# EAGLE design clipper_and_clamper (EAGLE 6.1)
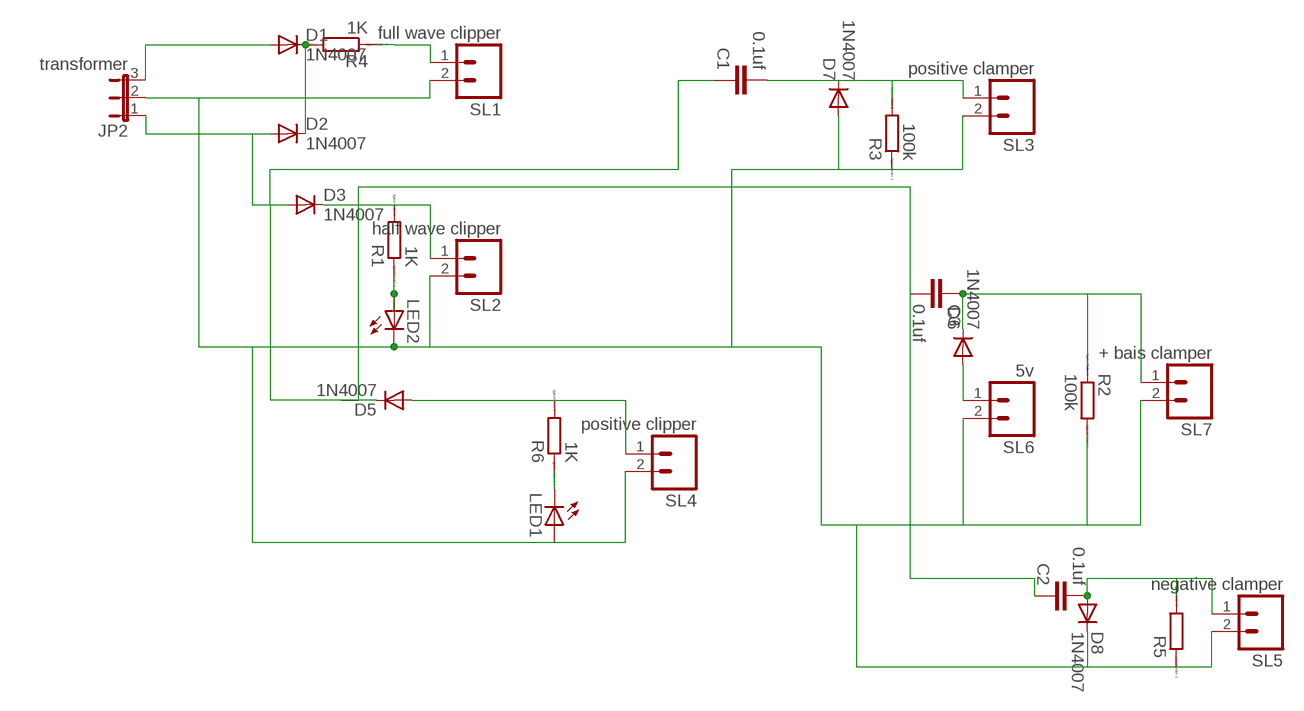
[diagram p0: schematic, sheet 1]

## Parts
C1  0.1uf  C2,5-3  [C2.5-3]
C2  0.1uf  C2,5-3  [C2.5-3]
C3  0.1uf  C2,5-3  [C2.5-3]
D1  1N4007  1N4004  [DO41-10]
D2  1N4007  1N4004  [DO41-10]
D3  1N4007  1N4004  [DO41-10]
D5  1N4007  1N4004  [DO41-10]
D6  1N4007  1N4004  [DO41-10]
D7  1N4007  1N4004  [DO41-10]
D8  1N4007  1N4004  [DO41-10]
JP2  transformer  JP2E  [JP2]
LED1  LED3MM  [LED3MM]
LED2  LED3MM  [LED3MM]
R1  1K  R0204/7  [0204/7]
R2  100k  R0204/7  [0204/7]
R3  100k  R0204/7  [0204/7]
R4  1K  R0204/7  [0204/7]
R5  R0204/7  [0204/7]
R6  1K  R0204/7  [0204/7]
SL1  full wave clipper  M02  [02P]
SL2  half wave clipper  M02  [02P]
SL3  positive clamper  M02  [02P]
SL4  positive clipper  M02  [02P]
SL5  negative clamper  M02  [02P]
SL6  5v  M02  [02P]
SL7  + bais clamper  M02  [02P]

## Nets
N$1: D1.C D2.C R4.2
N$2: D1.A JP2.3
N$3: C1.1 C2.1 C3.2 D2.A D3.A D5.C JP2.1
N$4: D7.A D8.C JP2.2 LED1.A LED2.K(C) R2.2 R3.1 R5.1 SL1.2 SL2.2 SL3.2 SL4.2 SL5.2 SL6.2 SL7.2
N$5: R4.1 SL1.1
N$6: D3.C R1.2 SL2.1
N$7: LED2.A R1.1
N$8: C2.2 D8.A R5.2 SL5.1
N$9: D5.A R6.2 SL4.1
N$10: LED1.K(C) R6.1
N$11: C1.2 D7.C R3.2 SL3.1
N$13: D6.A SL6.1
N$15: C3.1 D6.C R2.1 SL7.1

## Library data of the parts
C1-C3 = capacitor-wima:C: CAPACITOR naming: grid - package width
D1-D3 D5-D8 = diode:1N4004: DIODE general purpose rectifier, 1 A
JP2 = jumper:JP2E: JUMPER
LED1 LED2 = led:LED: LED OSRAM: - CHIPLED LG R971, LG N971, LY N971, LG Q971, LY Q971, LO R971, LY R971 LH N974, LH R974 LS Q976, LO Q976, LY Q976 LO Q996 - Hyper CHIPLED LW Q18S LB Q993, LB Q99A, LB R99A - SideLED LS A670, LO A670, LY A670, LG A670, LP A670 LB A673, LV A673, LT A673, LW A673 LH A674 LY A675 LS A676, LA A676, LO A676, LY A676, LW A676 LS A679, LY A679, LG A679 - Hyper Micro SIDELED® LS Y876, LA Y876, LO Y876, LY Y876 LT Y87S - SmartLED LW L88C, LW L88S LB L89C, LB L89S, LG L890 LS L89K, LO L89K, LY L89K LS L896, LA L896, LO L896, LY L896 - TOPLED LS T670, LO T670, LY T670, LG T670, LP T670 LSG T670, LSP T670, LSY T670, LOP T670, LYG T670 LG T671, LOG T671, LSG T671 LB T673, LV T673, LT T673, LW T673 LH T674 LS T676, LA T676, LO T676, LY T676, LB T676, LH T676, LSB T676, LW T676 LB T67C, LV T67C, LT T67C, LS T67K, LO T67K, LY T67K, LW E67C LS E67B, LA E67B, LO E67B, LY E67B, LB E67C, LV E67C, LT E67C LW T67C LS T679, LY T679, LG T679 LS T770, LO T770, LY T770, LG T770, LP T770 LB T773, LV T773, LT T773, LW T773 LH T774 LS E675, LA E675, LY E675, LS T675 LS T776, LA T776, LO T776, LY T776, LB T776 LHGB T686 LT T68C, LB T68C - Hyper Mini TOPLED® LB M676 - Mini TOPLED Santana® LG M470 LS M47K, LO M47K, LY M47K Source: http://www.osram.convergy.de LUXEON: - LUMILED® LXK2-PW12-R00, LXK2-PW12-S00, LXK2-PW14-U00, LXK2-PW14-V00 LXK2-PM12-R00, LXK2-PM12-S00, LXK2-PM14-U00 LXK2-PE12-Q00, LXK2-PE12-R00, LXK2-PE12-S00, LXK2-PE14-T00, LXK2-PE14-U00 LXK2-PB12-K00, LXK2-PB12-L00, LXK2-PB12-M00, LXK2-PB14-N00, LXK2-PB14-P00, LXK2-PB14-Q00 LXK2-PR12-L00, LXK2-PR12-M00, LXK2-PR14-Q00, LXK2-PR14-R00 LXK2-PD12-Q00, LXK2-PD12-R00, LXK2-PD12-S00 LXK2-PH12-R00, LXK2-PH12-S00 LXK2-PL12-P00, LXK2-PL12-Q00, LXK2-PL12-R00 Source: www.luxeon.com KINGBRIGHT: KA-3528ASYC Source: www.kingbright.com
R1-R6 = eagle-ltspice:R: RESISTOR, European symbol; SPICEMODEL: NONE; SPICEPREFIX: R
SL1-SL7 = con-amp-quick:M02: AMP QUICK CONNECTOR; OC_FARNELL: unknown; OC_NEWARK: unknown

## Board
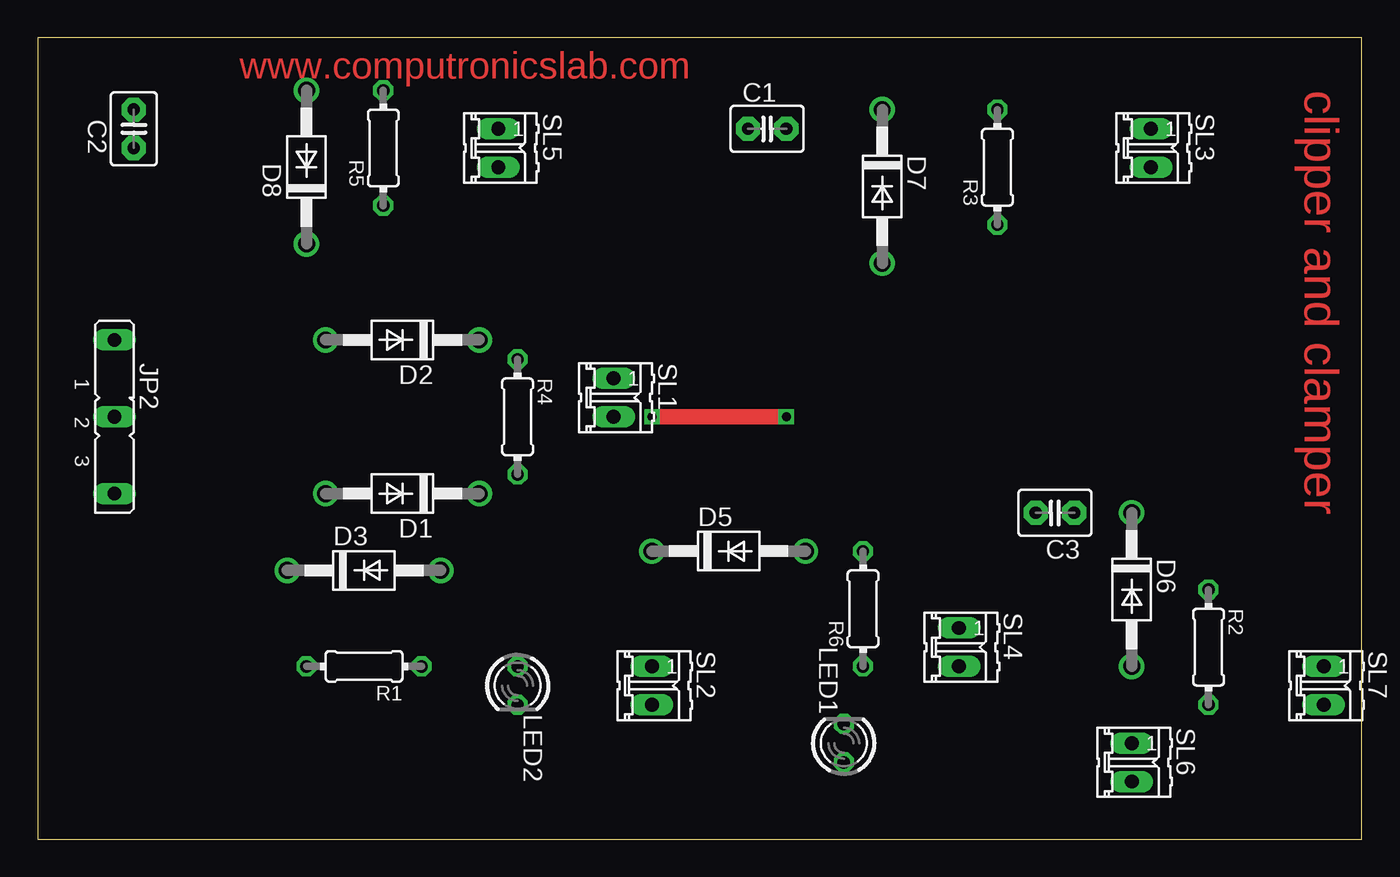
[diagram p1: board, top side]
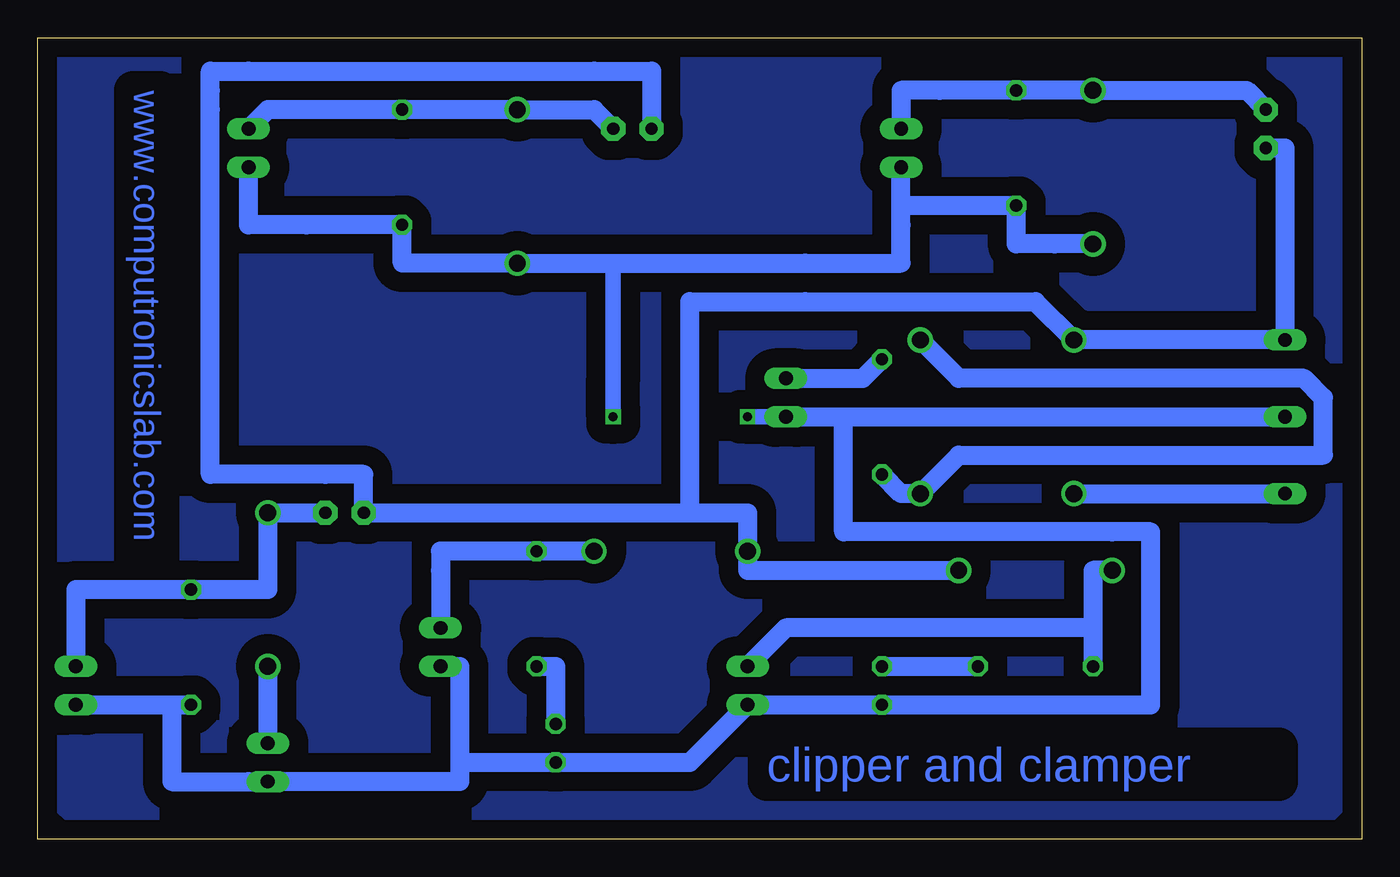
[diagram p2: board, bottom side, seen from below]

Size 87.61 x 53.01 mm. Coordinates in mm from the lower left corner, seen from the top.
Outline: 0,0 87.61,0 87.61,53.01 0,53.01 0,0
Copper layers (1*16): Top 0.035mm / dielectric 1.5mm / Bottom 0.035mm
Design rules: minimum track width 50mil, minimum drill 24mil, track to track 8mil, track to pad 8mil, pad to pad 8mil, via to via 8mil, smd to smd 8mil, copper to edge 40mil, drill to drill 8mil, minimum pad ring 10mil, minimum via ring 8mil, stop-mask expansion 4mil, vias tented up to drill 0mil, thermal gap 10mil

### Footprints (pad centres in the part's own frame; a part is rotated, then mirrored left to right if it is on the bottom)
C2.5-3 = drill 0.813 pad 1.6 octagon: 1 -1.27,0; 2 1.27,0
DO41-10 = drill 1.118: A 5.08,0; C -5.08,0
JP2 = drill 0.914 long: 1 -5.08,0; 2 0,0; 3 5.08,0
LED3MM = drill 0.813 octagon: A -1.27,0; K 1.27,0
0204/7 = drill 0.813 octagon: 1 -3.81,0; 2 3.81,0
02P = drill 0.914 long: 1 -1.27,0; 2 1.27,0

### Placement (x,y rotation side)
C1  48.26,46.99 0 top
C2  6.35,46.99 90 top
C3  67.31,21.59 180 top
D1  24.13,22.86 180 top
D2  24.13,33.02 180 top
D3  21.59,17.78 0 top
D5  45.72,19.05 0 top
D6  72.39,16.51 270 top
D7  55.88,43.18 270 top
D8  17.78,44.45 90 top
JP2  5.08,27.94 270 top
LED1  53.34,6.35 90 top
LED2  31.75,10.16 270 top
R1  21.59,11.43 180 top
R2  77.47,12.7 270 top
R3  63.5,44.45 90 top
R4  31.75,27.94 270 top
R5  22.86,45.72 90 top
R6  54.61,15.24 90 top
SL1  38.1,29.21 270 top
SL2  40.64,10.16 270 top
SL3  73.66,45.72 270 top
SL4  60.96,12.7 270 top
SL5  30.48,45.72 270 top
SL6  72.39,5.08 270 top
SL7  85.09,10.16 270 top

### Tracks (layer width: path | path; a pad name or v marks a point on that pad's centre or on a via)
N$1
  Bottom 1.27: R4.2 30.48,22.86 D1.C 26.67,25.4 2.54,25.4 2.54,29.21 3.81,30.48 26.67,30.48 D2.C
N$2
  Bottom 1.27: D1.A JP2.3
N$3
  Bottom 1.27: C2.1 5.08,45.72 JP2.1 D2.A 21.59,35.56 36.83,35.56 44.45,35.56 44.45,21.59 50.8,21.59 | D3.A 39.37,17.78 40.64,17.78 D5.C 40.64,21.59 43.18,21.59 50.8,21.59 | C1.1 46.99,50.8 50.8,50.8 73.66,50.8 76.2,50.8 76.2,49.53 76.2,48.26 76.2,24.13 68.58,24.13 66.04,24.13 C3.2 50.8,21.59
N$4  (via drill 0.6)
  Top 1.016: v40.64,27.94 v49.53,27.94
  Bottom 0.406: 36.83,38.1 49.53,38.1 | 49.53,30.48 v49.53,27.94
  Bottom 1.016: 49.53,38.1 49.53,30.48 v49.53,27.94 | SL1.2 v40.64,27.94
  Bottom 1.27: SL1.2 34.29,27.94 | 34.29,27.94 JP2.2 | SL7.2 78.74,8.89 | 78.74,8.89 R2.2 | 78.74,8.89 78.74,3.81 73.66,3.81 SL6.2 68.58,3.81 59.69,3.81 59.69,11.43 | 59.69,11.43 59.69,5.08 LED1.A 44.45,5.08 SL2.2 LED2.K 13.97,8.89 13.97,17.78 13.97,20.32 16.51,20.32 34.29,20.32 34.29,27.94 | 59.69,11.43 SL4.2 59.69,11.43 | D8.C 20.32,39.37 22.86,39.37 22.86,40.64 R5.1 27.94,41.91 30.48,41.91 SL5.2 30.48,40.64 30.48,38.1 36.83,38.1 D7.A 60.96,38.1 63.5,38.1 R3.1 69.85,40.64 73.66,40.64 73.66,41.91 SL3.2
N$5
  Bottom 1.27: R4.1 33.02,30.48 SL1.1
N$6
  Bottom 1.27: 17.78,13.97 17.78,17.78 D3.C | 17.78,13.97 R1.2 | SL2.1 38.1,13.97 17.78,13.97
N$7
  Bottom 1.27: LED2.A R1.1
N$8
  Bottom 1.27: SL5.1 30.48,49.53 27.94,49.53 R5.2 D8.A 7.62,49.53 C2.2
N$9
  Bottom 1.27: D5.A R6.2 55.88,19.05 60.96,19.05 60.96,17.78 SL4.1
N$10
  Bottom 1.27: LED1.K 53.34,11.43 R6.1
N$11
  Bottom 1.27: SL3.1 72.39,48.26 R3.2 D7.C 50.8,48.26 C1.2
N$12
  pour Bottom (isolate 1.27): 5.08,0 3.81,0 0,3.81 0,50.8 2.54,53.34 85.09,53.34 87.63,50.8 87.63,3.81 83.82,0
N$13
  Bottom 1.27: D6.A SL6.1
N$15
  Bottom 1.27: SL7.1 85.09,15.24 85.09,16.51 80.01,16.51 R2.1 72.39,16.51 D6.C C3.1

### Text on the board
Top: www.computronicslab.com | clipper and clamper
Bottom: www.computronicslab.com | clipper and clamper